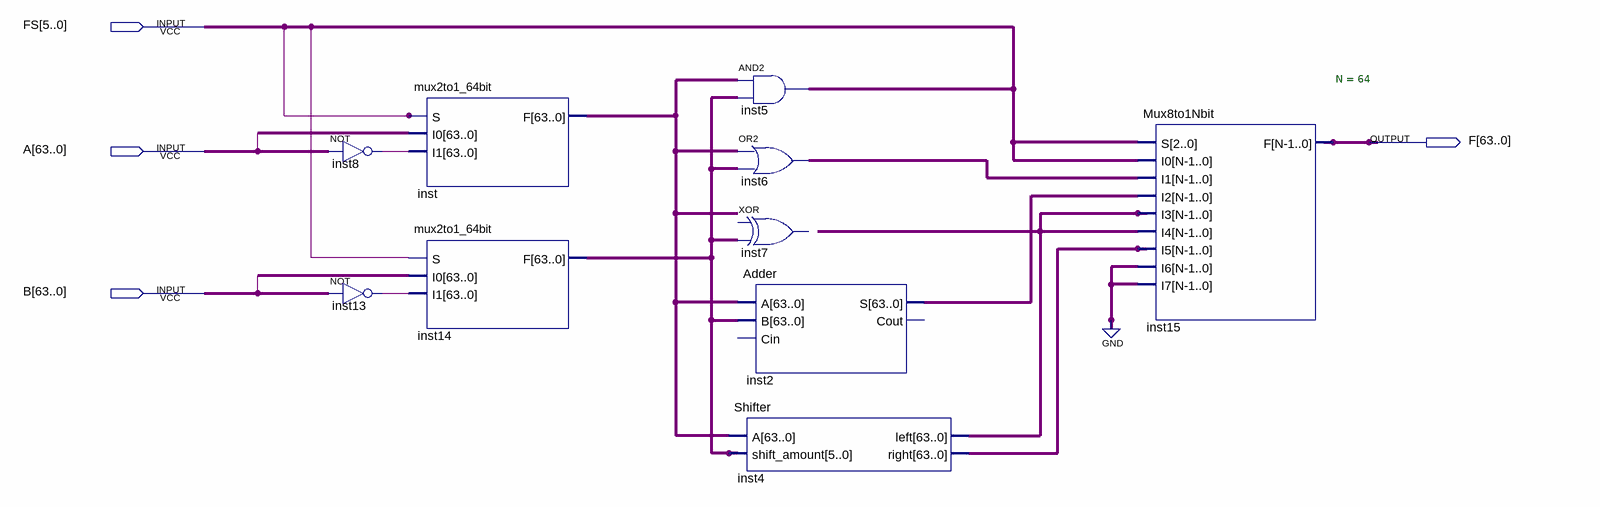
[diagram p0: schematic sheet]
// Quartus schematic ALUschem.bdf as structural Verilog: 10 symbols, 4 pins
module ALUschem (
  input  [5:0] FS,
  input  [63:0] A,
  input  [63:0] B,
  output [63:0] F
);

  wire inst8_out, inst13_out, undriven_3, undriven_4;
  wire [63:0] inst2_s, inst4_left, inst4_right, inst6_out, inst14_f, inst_f, undriven, undriven_2;

  assign inst8_out = ~A;  // NOT inst8, 64 bits wide
  assign inst13_out = ~B;  // NOT inst13, 64 bits wide
  mux2to1_64bit inst (.S(undriven_3), .I0(undriven), .I1({64{inst8_out}}), .F(inst_f));
  mux2to1_64bit inst14 (.S(undriven_4), .I0(undriven_2), .I1({64{inst13_out}}), .F(inst14_f));
  assign FS = inst_f & inst14_f;  // AND2 inst5, 64 bits wide
  assign inst6_out = inst_f | inst14_f;  // OR2 inst6, 64 bits wide
  // XOR inst7 has open pins: IN1=open, IN2=inst14_f, OUT=open
  Adder inst2 (.A(inst_f), .B(inst14_f), .S(inst2_s));  // open: Cin, Cout
  Shifter inst4 (.A(inst_f), .shift_amount(inst14_f), .left(inst4_left), .right(inst4_right));
  Mux8to1Nbit #(.N(64)) inst15 (
    .S(FS), .I0(FS), .I1(inst6_out), .I2(inst2_s), .I3(inst4_left), .I4(inst4_left), .I5(inst4_right),
    .I6({64{1'b0}}), .I7({64{1'b0}}), .F(F));
endmodule
